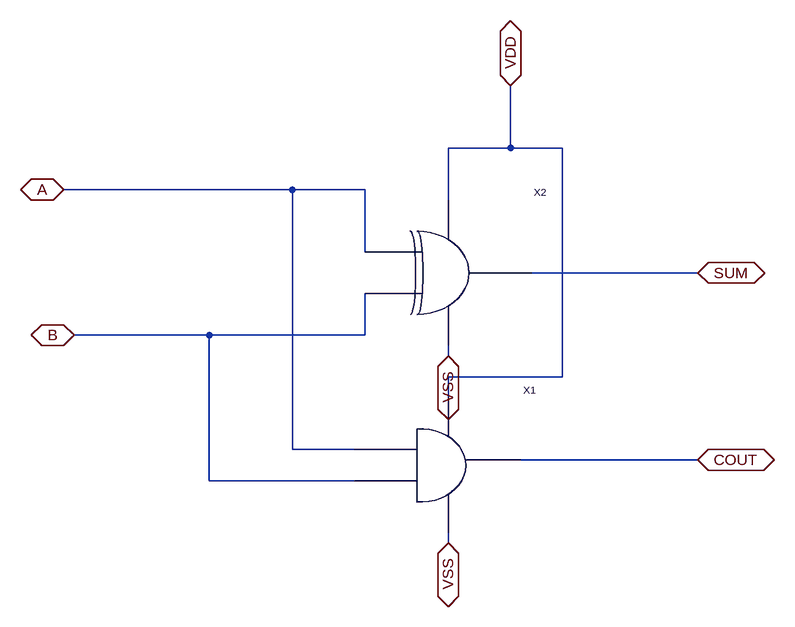
[diagram p0: schematic halfadderimply.asc]
halfadderimply.asc, the LTspice schematic file:
Version 4
SHEET 1 880 680
WIRE 368 -256 368 -352
WIRE 368 -256 272 -256
WIRE 448 -256 368 -256
WIRE 32 -192 -320 -192
WIRE 144 -192 32 -192
WIRE 272 -176 272 -256
WIRE 144 -96 144 -192
WIRE 656 -64 400 -64
WIRE -96 32 -304 32
WIRE 144 32 144 -32
WIRE 144 32 -96 32
WIRE 272 64 272 48
WIRE 448 96 448 -256
WIRE 448 96 272 96
WIRE 272 128 272 96
WIRE 32 208 32 -192
WIRE 128 208 32 208
WIRE 656 224 384 224
WIRE -96 256 -96 32
WIRE 128 256 -96 256
WIRE 272 352 272 336
FLAG 656 -64 SUM
IOPIN 656 -64 BiDir
FLAG 656 224 COUT
IOPIN 656 224 BiDir
FLAG -320 -192 A
IOPIN -320 -192 BiDir
FLAG -304 32 B
IOPIN -304 32 BiDir
FLAG 368 -352 VDD
IOPIN 368 -352 BiDir
FLAG 272 64 VSS
IOPIN 272 64 BiDir
FLAG 272 352 VSS
IOPIN 272 352 BiDir
SYMBOL andgateimply 160 224 R0
SYMATTR InstName X1
SYMBOL xorgateimply 160 -64 R0
SYMATTR InstName X2

The netlist it stands for:
* halfadderimply.asc
XX1 VDD VSS A B COUT andgateimply  ; pins VDD VSS A B OUT
XX2 A B SUM VDD VSS xorgateimply  ; pins A B OUT VDD VSS
.backanno
.end